# EAGLE design RN52_BO (EAGLE 8.6.0)
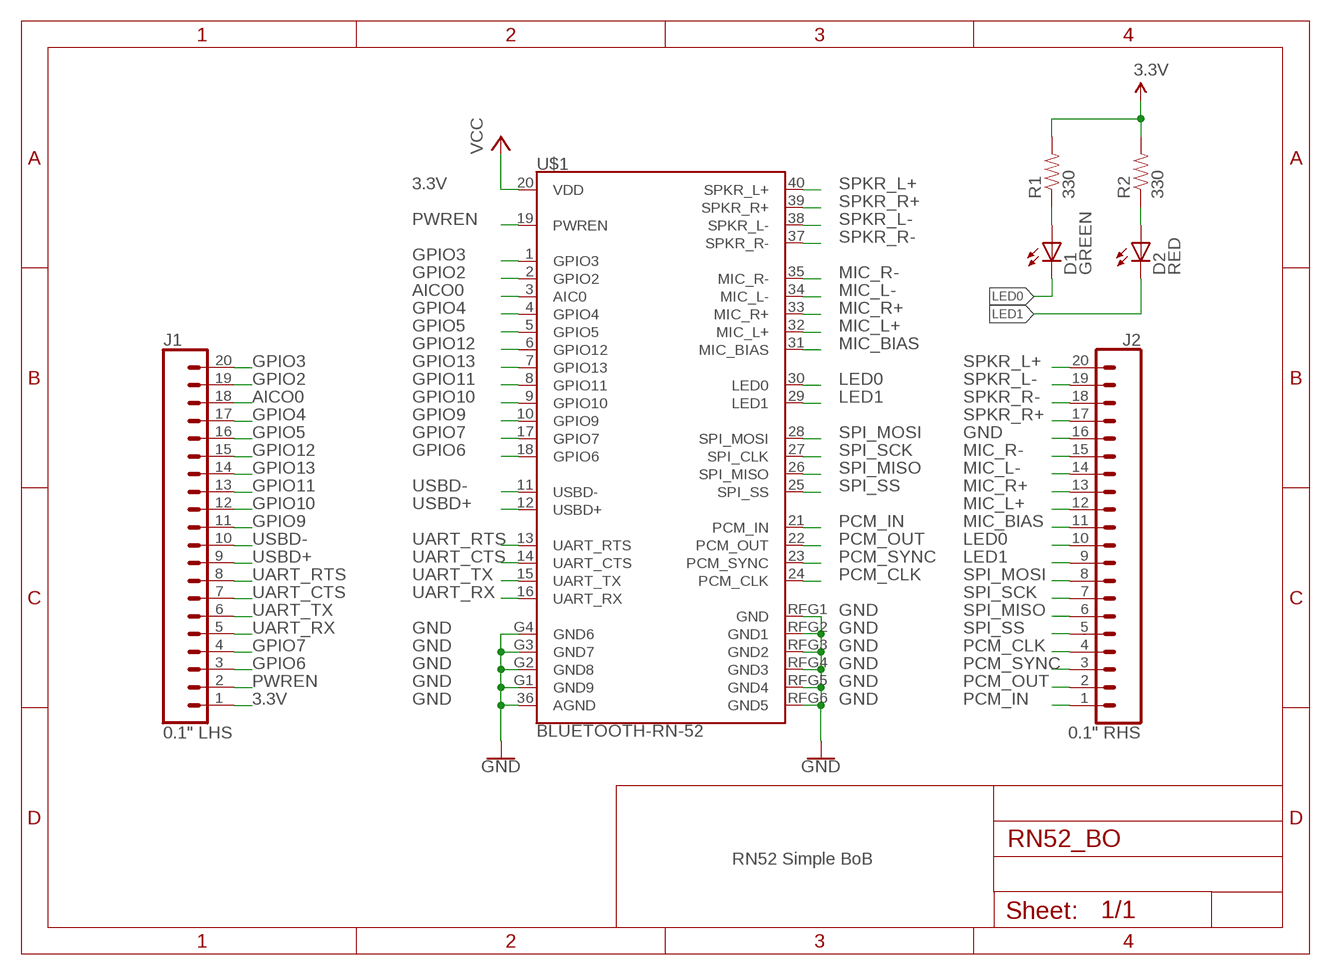
[diagram p0: schematic, sheet 1]
FRAME2 (DINA5_L): RN52BOB: RN52 Simple BoB

## Parts
D1  GREEN  LED-GREEN0603  [LED-0603]
D2  RED  LED-RED0603  [LED-0603]
J1  0.1" LHS  CONN_20  [1X20]
J2  0.1" RHS  CONN_20  [1X20]
R1  330  RESISTOR0603-RES  [0603-RES]
R2  330  RESISTOR0603-RES  [0603-RES]
U$1  BLUETOOTH-RN-52  [RN-52]

## Nets
3.3V: J1.1 R1.2 R2.2 U$1.20(VDD) ; supply symbol labelled VCC
AICO0: J1.18 U$1.3(AIC0)
GND: J2.16 U$1.36(AGND) U$1.G1(GND9) U$1.G2(GND8) U$1.G3(GND7) U$1.G4(GND6) U$1.RFG1(GND) U$1.RFG2(GND1) U$1.RFG3(GND2) U$1.RFG4(GND3) U$1.RFG5(GND4) U$1.RFG6(GND5)
GPIO2: J1.19 U$1.2(GPIO2)
GPIO3: J1.20 U$1.1(GPIO3)
GPIO4: J1.17 U$1.4(GPIO4)
GPIO5: J1.16 U$1.5(GPIO5)
GPIO6: J1.3 U$1.18(GPIO6)
GPIO7: J1.4 U$1.17(GPIO7)
GPIO9: J1.11 U$1.10(GPIO9)
GPIO10: J1.12 U$1.9(GPIO10)
GPIO11: J1.13 U$1.8(GPIO11)
GPIO12: J1.15 U$1.6(GPIO12)
GPIO13: J1.14 U$1.7(GPIO13)
LED0: D1.C J2.10 U$1.30(LED0)
LED1: D2.C J2.9 U$1.29(LED1)
MIC_BIAS: J2.11 U$1.31(MIC_BIAS)
MIC_L+: J2.12 U$1.32(MIC_L+)
MIC_L-: J2.14 U$1.34(MIC_L-)
MIC_R+: J2.13 U$1.33(MIC_R+)
MIC_R-: J2.15 U$1.35(MIC_R-)
N$1: D2.A R2.1
N$2: D1.A R1.1
PCM_CLK: J2.4 U$1.24(PCM_CLK)
PCM_IN: J2.1 U$1.21(PCM_IN)
PCM_OUT: J2.2 U$1.22(PCM_OUT)
PCM_SYNC: J2.3 U$1.23(PCM_SYNC)
PWREN: J1.2 U$1.19(PWREN)
SPI_MISO: J2.6 U$1.26(SPI_MISO)
SPI_MOSI: J2.8 U$1.28(SPI_MOSI)
SPI_SCK: J2.7 U$1.27(SPI_CLK)
SPI_SS: J2.5 U$1.25(SPI_SS)
SPKR_L+: J2.20 U$1.40(SPKR_L+)
SPKR_L-: J2.19 U$1.38(SPKR_L-)
SPKR_R+: J2.17 U$1.39(SPKR_R+)
SPKR_R-: J2.18 U$1.37(SPKR_R-)
UART_CTS: J1.7 U$1.14(UART_CTS)
UART_RTS: J1.8 U$1.13(UART_RTS)
UART_RX: J1.5 U$1.16(UART_RX)
UART_TX: J1.6 U$1.15(UART_TX)
USBD+: J1.9 U$1.12(USBD+)
USBD-: J1.10 U$1.11(USBD-)

## Library data of the parts
D1 = SparkFun-LED:LED-GREEN: Various green LEDs 0603- DIO-00821 LARGE- DIO-00862 LILYPAD- DIO-09910; PROD_ID: DIO-00821
D2 = SparkFun-LED:LED-RED: Assorted Red LEDs LilyPad 1206- DIO-09912 1206- DIO-00809 0603- DIO-00819; PROD_ID: DIO-00819
J1 = SparkFun-Connectors:CONN_20: Multi connection point. Often used as Generic Header-pin footprint for 0.1 inch spaced/style header connections On any of the 0.1 inch spaced packages, you can populate with these: Break Away Headers - Straight <https://www.sparkfun.com/products/116> (PRT-00116) Break Away Male Headers - Right Angle <https://www.sparkfun.com/products/553> (PRT-00553) Female Headers <https://www.sparkfun.com/products/115> (PRT-00115) Break Away Headers - Machine Pin <https://www.sparkfun.com/products/117> (PRT-00117) Break Away Female Headers - Swiss Machine Pin <https://www.sparkfun.com/products/743> (PRT-00743) For SCREWTERMINALS and SPRING TERMINALS visit here: Screw Terimnals on SparkFun.com <https://www.sparkfun.com/search/results?term=Screw+Terminals> (5mm/3.5mm/2.54mm spacing) This device is also useful as a general connection point to wire up your design to another part of your project. Our various solder wires solder well into these plated through hole pads. Hook-Up Wire - Assortment (Stranded, 22 AWG) <https://www.sparkfun.com/products/11375> (PRT-11375) Hook-Up Wire - Assortment (Solid Core, 22 AWG) <https://www.sparkfun.com/products/11367> (PRT-11367) View the entire wire category on our website here <https://www.sparkfun.com/categories/141> Special notes: Molex polarized connector foot print use with SKU : PRT-08231 with associated crimp pins and housings. 1MM SMD Version SKU: PRT-10208 NOTES ON THE VARIANTS LOCK and LOCK_LONGPADS... This footprint was designed to help hold the alignment of a through-hole component (i.e. 6-pin header) while soldering it into place. You may notice that each hole has been shifted either up or down by 0.005 of an inch from it's more standard position (which is a perfectly straight line). This slight alteration caused the pins (the squares in the middle) to touch the edges of the holes. Because they are alternating, it causes a "brace" to hold the component in place. 0.005 has proven to be the perfect amount of "off-center" position when using our standard breakaway headers. Although looks a little odd when you look at the bare footprint, once you have a header in there, the alteration is very hard to notice. Also,if you push a header all the way into place, it is covered up entirely on the bottom side. Note about LOCK SPECIAL package: This is just like the LOCK variant in that the holes are staggared by 5 mil, but except for the last two holes. They are not altered from the "standard" footprint layout. This is used for a special purpose on the layout of our Graphic LCD Backpack. Make sure you want to use this device before selecting it for you project!; TITLE: 0.1" LHS
J2 = SparkFun-Connectors:CONN_20: Multi connection point. Often used as Generic Header-pin footprint for 0.1 inch spaced/style header connections On any of the 0.1 inch spaced packages, you can populate with these: Break Away Headers - Straight <https://www.sparkfun.com/products/116> (PRT-00116) Break Away Male Headers - Right Angle <https://www.sparkfun.com/products/553> (PRT-00553) Female Headers <https://www.sparkfun.com/products/115> (PRT-00115) Break Away Headers - Machine Pin <https://www.sparkfun.com/products/117> (PRT-00117) Break Away Female Headers - Swiss Machine Pin <https://www.sparkfun.com/products/743> (PRT-00743) For SCREWTERMINALS and SPRING TERMINALS visit here: Screw Terimnals on SparkFun.com <https://www.sparkfun.com/search/results?term=Screw+Terminals> (5mm/3.5mm/2.54mm spacing) This device is also useful as a general connection point to wire up your design to another part of your project. Our various solder wires solder well into these plated through hole pads. Hook-Up Wire - Assortment (Stranded, 22 AWG) <https://www.sparkfun.com/products/11375> (PRT-11375) Hook-Up Wire - Assortment (Solid Core, 22 AWG) <https://www.sparkfun.com/products/11367> (PRT-11367) View the entire wire category on our website here <https://www.sparkfun.com/categories/141> Special notes: Molex polarized connector foot print use with SKU : PRT-08231 with associated crimp pins and housings. 1MM SMD Version SKU: PRT-10208 NOTES ON THE VARIANTS LOCK and LOCK_LONGPADS... This footprint was designed to help hold the alignment of a through-hole component (i.e. 6-pin header) while soldering it into place. You may notice that each hole has been shifted either up or down by 0.005 of an inch from it's more standard position (which is a perfectly straight line). This slight alteration caused the pins (the squares in the middle) to touch the edges of the holes. Because they are alternating, it causes a "brace" to hold the component in place. 0.005 has proven to be the perfect amount of "off-center" position when using our standard breakaway headers. Although looks a little odd when you look at the bare footprint, once you have a header in there, the alteration is very hard to notice. Also,if you push a header all the way into place, it is covered up entirely on the bottom side. Note about LOCK SPECIAL package: This is just like the LOCK variant in that the holes are staggared by 5 mil, but except for the last two holes. They are not altered from the "standard" footprint layout. This is used for a special purpose on the layout of our Graphic LCD Backpack. Make sure you want to use this device before selecting it for you project!; TITLE: 0.1" RHS
R1 R2 = SparkFun-Resistors:RESISTOR: Resistor Basic schematic elements and footprints for 0603, 1206, and PTH resistors.
U$1 = SparkFun-RF:BLUETOOTH-RN-52: Roving Networks RN-52 Bluetooth Audio Module The RN-52 is an audio module that provides a highly integrated solution for delivering high quality stereo audio in a small form factor with little difficulty. This module is perfect for a project involving hands free audio for your car, remote controlling your media center, or streaming 2-channel audio. SparkFun Products: RN-52 - Bluetooth Audio Module <https://www.sparkfun.com/products/11678> (WRL-11678) Audio Bluetooth Breakout - RN-52 <https://www.sparkfun.com/products/12849> (WRL-12849); PROD_ID: IC-11569; SF_ID: WRL-11678

## Board
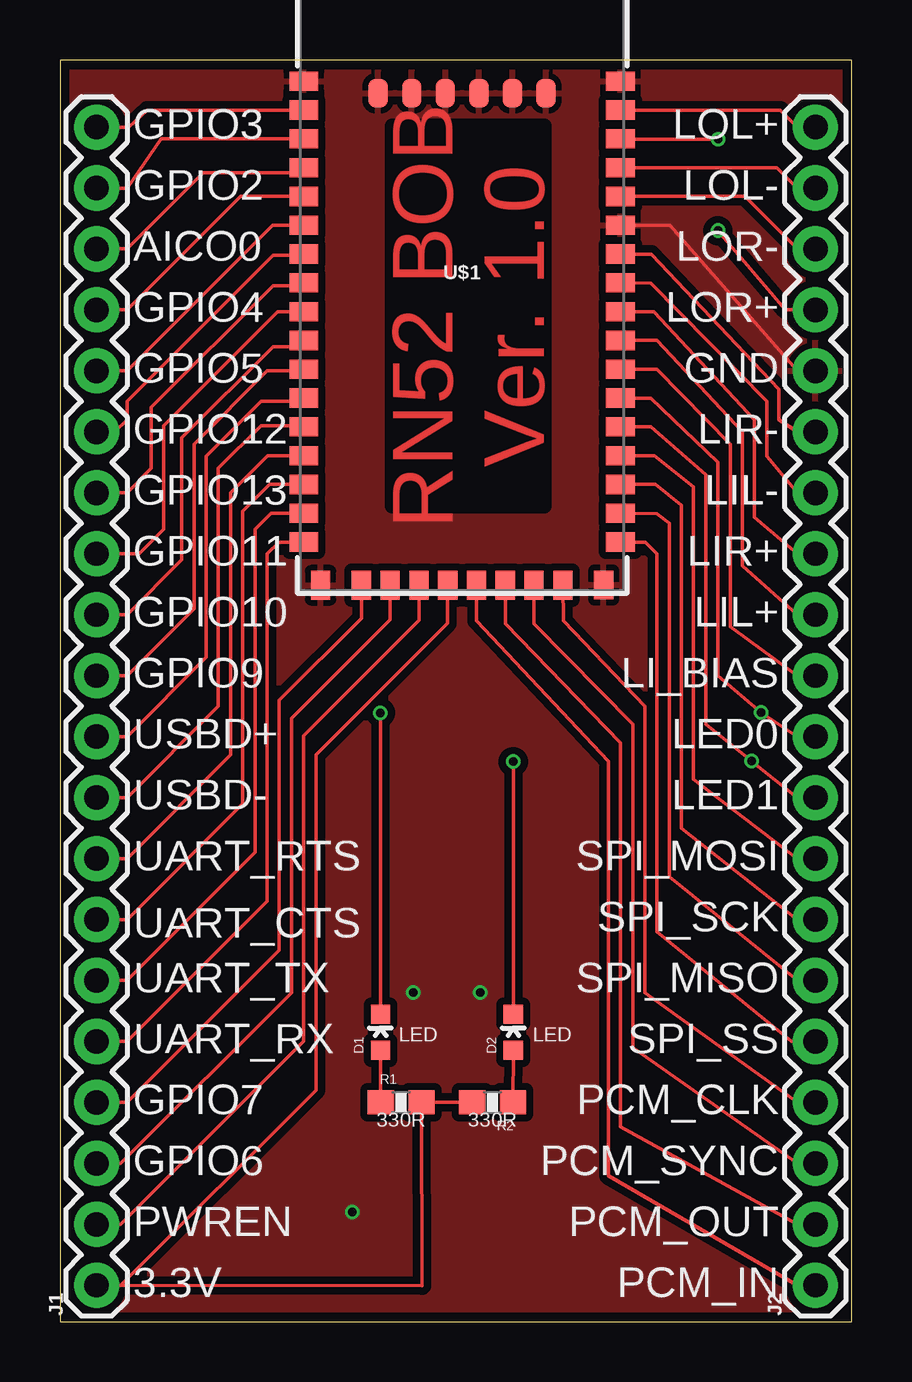
[diagram p1: board, top side]
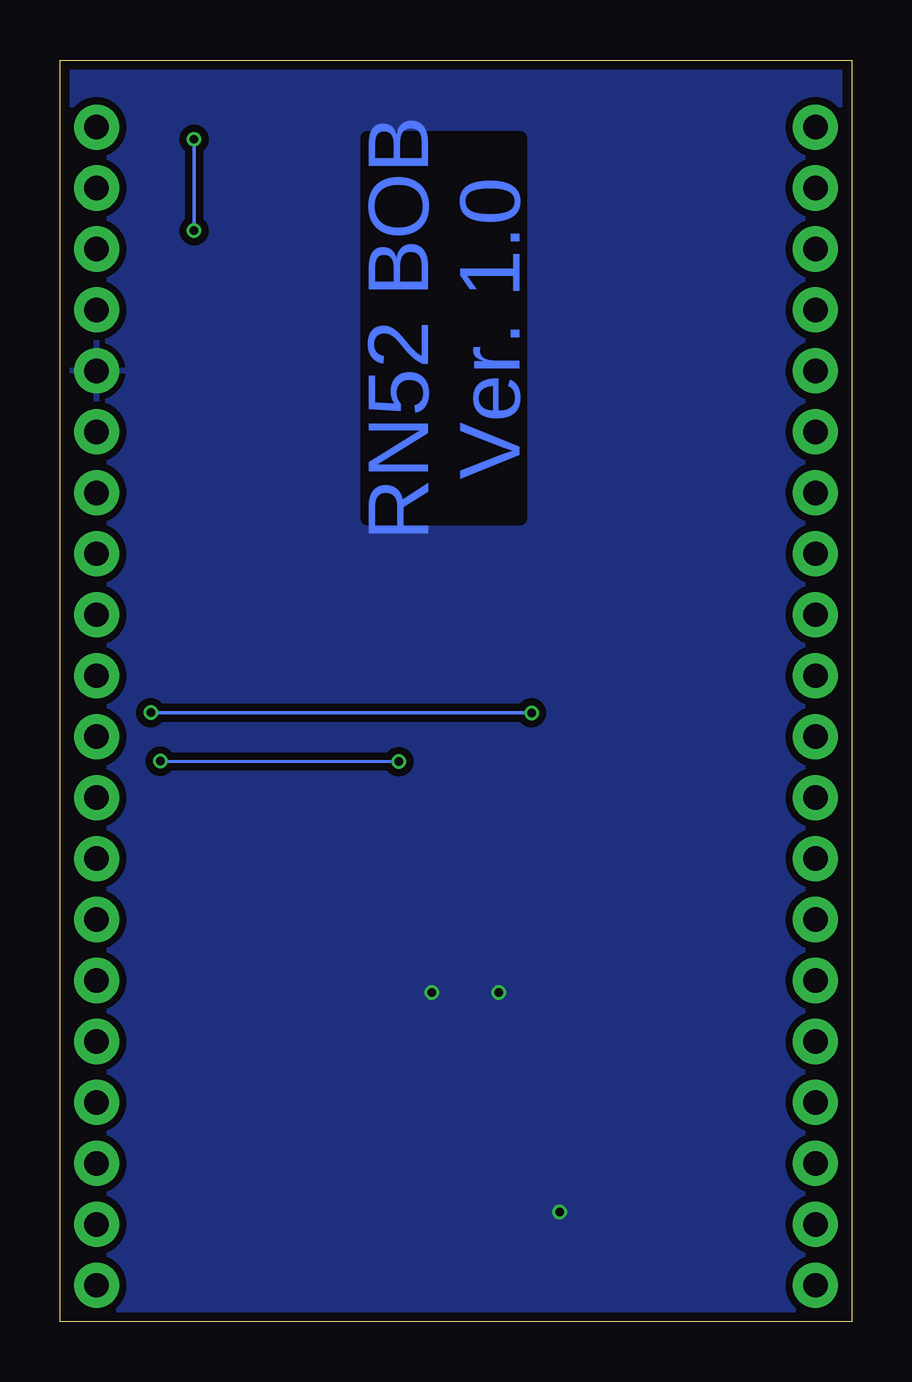
[diagram p2: board, bottom side, seen from below]

Size 33.02 x 52.58 mm. Coordinates in mm from the lower left corner, seen from the top.
Outline: 0,0 33.02,0 33.02,52.58 0,52.58 0,0
Copper layers (1*16): Top 0.035559375mm / dielectric 1.6mm / Bottom 0.035559375mm
Design rules "oshpark-2layer": minimum track width 6mil, minimum drill 10mil, track to track 6mil, track to pad 6mil, pad to pad 6mil, via to via 6mil, smd to smd 6mil, copper to edge 15mil, drill to drill 6mil, minimum pad ring 5mil, minimum via ring 5mil, stop-mask expansion 2.5mil, vias tented up to drill 0mil, thermal gap 10mil

### Footprints (pad centres in the part's own frame; a part is rotated, then mirrored left to right if it is on the bottom)
LED-0603 = smd 0.8 x 0.8: A 0,-0.75; C 0,0.75
1X20 = drill 1.016 pad 1.88: 1 0,0; 2 2.54,0; 3 5.08,0; 4 7.62,0; 5 10.16,0; 6 12.7,0; 7 15.24,0; 8 17.78,0; 9 20.32,0; 10 22.86,0; 11 25.4,0; 12 27.94,0; 13 30.48,0; 14 33.02,0; 15 35.56,0; 16 38.1,0; 17 40.64,0; 18 43.18,0; 19 45.72,0; 20 48.26,0
0603-RES = smd 1.1 x 1: 1 -0.85,0; 2 0.85,0
RN-52 = smd 1.2 x 0.8: 1 -6.6,8.33; 2 -6.6,7.13; 3 -6.6,5.93; 4 -6.6,4.73; 5 -6.6,3.53; 6 -6.6,2.33; 7 -6.6,1.13; 8 -6.6,-0.07; 9 -6.6,-1.27; 10 -6.6,-2.47; 11 -6.6,-3.67; 12 -6.6,-4.87; 13 -6.6,-6.07; 14 -6.6,-7.27; 15 -6.6,-8.47; 16 -6.6,-9.67; 25 6.6,-9.67; 26 6.6,-8.47; 27 6.6,-7.27; 28 6.6,-6.07; 29 6.6,-4.87; 30 6.6,-3.67; 31 6.6,-2.47; 32 6.6,-1.27; 33 6.6,-0.07; 34 6.6,1.13; 35 6.6,2.33; 36 6.6,3.53; 37 6.6,4.73; 38 6.6,5.93; 39 6.6,7.13; 40 6.6,8.33; G1 -6.6,9.53; G4 6.6,9.53 | smd 0.8 x 1.2: 17 -4.2,-11.47; 18 -3,-11.47; 19 -1.8,-11.47; 20 -0.6,-11.47; 21 0.6,-11.47; 22 1.8,-11.47; 23 3,-11.47; 24 4.2,-11.47; G2 -5.9,-11.47; G3 5.9,-11.46; RFG1 -3.5,9.03; RFG2 -2.1,9.03; RFG3 -0.7,9.03; RFG4 0.7,9.03; RFG5 2.1,9.03; RFG6 3.5,9.03

### Placement (x,y rotation side)
D1  13.36,12.06 0 top
D2  18.9,12.06 0 top
J1  1.52,1.52 90 top
J2  31.5,1.52 90 top
R1  14.22,9.14 0 top
R2  18.03,9.14 180 top
U$1  16.76,42.16 0 top

### Tracks (layer width: path | path; a pad name or v marks a point on that pad's centre or on a via)
3.3V
  Top 0.152: R2.2 R1.2 15.09,1.5 2.54,1.52 | U$1.20 16.16,29.12 10.67,23.62 10.67,9.65 2.54,1.52 | 2.54,1.52 J1.1
AICO0
  Top 0.152: J1.18 2.79,44.7 5.97,47.88 9.95,47.88 U$1.3
GND  (via drill 0.35)
  Top 0.152: J2.16 30.73,39.62 25.43,45.7 24.66,45.7 U$1.36
  other vias: 12.19,4.57 14.73,13.72 17.53,13.72
  pour Top (isolate 0.305): 0,52.58 33.02,52.58 33.02,0 0,0
  pour Bottom (isolate 0.305): 0,52.58 33.02,52.58 33.02,0 0,0
GPIO2
  Top 0.152: J1.19 2.79,47.24 4.21,49.29 U$1.2
GPIO3
  Top 0.152: J1.20 2.87,49.78 3.63,50.49 U$1.1
GPIO4
  Top 0.152: J1.17 2.79,42.16 7.52,46.89 U$1.4
GPIO5
  Top 0.152: J1.16 2.79,39.62 8.86,45.69 U$1.5
GPIO6
  Top 0.152: U$1.18 13.76,29.26 9.65,25.15 9.65,13.72 2.54,6.6 J1.3
GPIO7
  Top 0.152: U$1.17 12.56,29.33 9.14,25.91 9.14,15.49 2.79,9.14 J1.4
GPIO9
  Top 0.152: J1.11 2.79,26.92 5.59,29.72 5.59,36.58 8.64,39.62 10.09,39.62 U$1.10
GPIO10
  Top 0.152: J1.12 2.79,29.46 5.08,31.75 5.08,36.83 8.89,40.64 9.91,40.64 U$1.9
GPIO11
  Top 0.152: U$1.8 9.07,42.09 4.32,37.34 4.32,33.02 3.3,32 J1.13
GPIO12
  Top 0.152: U$1.6 10.12,44.45 8.89,44.45 2.79,38.35 2.79,37.59 2.29,37.08 J1.15
GPIO13
  Top 0.152: J1.14 2.79,34.54 3.81,35.56 3.81,38.1 8.89,43.18 10.05,43.18 U$1.7
LED0  (via drill 0.35)
  Top 0.152: J2.10 30.73,24.38 v29.23,25.39 27.43,26.92 27.43,35.81 24.64,38.48 U$1.30 | v13.36,25.38 D1.C
  Bottom 0.152: v29.23,25.39 v13.36,25.38
LED1  (via drill 0.35)
  Top 0.152: J2.9 30.73,21.84 28.91,23.31 v28.84,23.36 26.92,24.89 26.92,35.31 24.64,37.29 U$1.29 | D2.C v18.9,23.34
  Bottom 0.152: v28.84,23.36 v18.9,23.34
MIC_BIAS
  Top 0.152: J2.11 30.73,26.92 27.94,28.96 27.94,36.58 24.89,39.7 U$1.31
MIC_L+
  Top 0.152: J2.12 30.73,29.46 28.45,31.5 28.45,37.08 24.89,40.89 U$1.32
MIC_L-
  Top 0.152: J2.14 30.73,34.54 29.46,36.07 29.46,38.35 24.64,43.28 U$1.34
MIC_R+
  Top 0.152: J2.13 30.73,32 28.96,33.53 28.96,37.59 24.77,42.09 U$1.33
MIC_R-
  Top 0.152: J2.15 30.73,37.08 29.97,37.59 29.97,38.86 24.66,44.48 U$1.35
N$1
  Top 0.152: D2.A R2.1
N$2
  Top 0.152: D1.A R1.1
PCM_CLK
  Top 0.152: J2.4 30.73,9.14 24.38,13.72 24.38,25.65 20.98,29.21 U$1.24
PCM_IN
  Top 0.152: U$1.21 17.36,29.21 22.86,23.37 22.86,6.1 30.73,1.52 J2.1
PCM_OUT
  Top 0.152: J2.2 30.73,4.06 23.37,8.13 23.37,24.13 18.57,29.08 U$1.22
PCM_SYNC
  Top 0.152: J2.3 30.73,6.6 23.88,11.43 23.88,24.89 19.76,29.08 U$1.23
PWREN
  Top 0.152: U$1.19 14.96,29.23 10.16,24.43 10.16,11.68 2.54,4.06 J1.2
SPI_MISO
  Top 0.152: J2.6 30.73,14.22 25.4,18.54 25.4,33.27 24.89,33.68 | U$1.26 24.89,33.68 | 24.89,33.68
SPI_MOSI
  Top 0.152: J2.8 30.73,19.3 26.42,22.61 26.42,34.8 24.79,36.09 U$1.28
SPI_SCK
  Top 0.152: J2.7 30.73,16.76 25.91,20.57 25.91,34.04 24.82,34.9 24.64,34.9 U$1.27
SPI_SS
  Top 0.152: U$1.25 24.41,32.49 24.89,32 24.89,16.26 30.48,11.68 J2.5
SPKR_L+
  Top 0.152: J2.20 30.73,49.78 30.02,50.49 U$1.40
SPKR_L-
  Top 0.152: J2.19 30.73,47.24 29.88,48.09 U$1.38
SPKR_R+  (via drill 0.35)
  Top 0.152: J2.17 30.25,42.16 v27.43,45.47 | U$1.39 23.38,49.28 v27.43,49.28
  Bottom 0.152: v27.43,45.47 v27.43,49.28
SPKR_R-
  Top 0.152: J2.18 30.73,44.7 28.54,46.89 U$1.37
UART_CTS
  Top 0.152: J1.7 2.79,16.76 7.62,21.59 7.62,33.78 8.73,34.89 U$1.14
UART_RTS
  Top 0.152: J1.8 2.79,19.3 7.11,23.62 7.11,34.54 8.66,36.09 U$1.13
UART_RX
  Top 0.152: U$1.16 9.13,32.49 8.64,32 8.64,17.53 2.79,11.68 J1.5
UART_TX
  Top 0.152: J1.6 2.79,14.22 8.13,19.56 8.13,33.02 8.8,33.69 U$1.15
USBD+
  Top 0.152: J1.9 2.79,21.84 6.6,25.65 6.6,35.56 8.38,37.34 10.12,37.34 U$1.12
USBD-
  Top 0.152: J1.10 2.79,24.38 6.1,27.69 6.1,36.07 8.38,38.35 10.02,38.35 U$1.11

### Text on the board
Top: RN52 BOB / Ver. 1.0
Bottom: RN52 BOB / Ver. 1.0
tPlace: GPIO3 | LOL+ | GPIO2 | LOL- | AICO0 | LOR- | GPIO4 | LOR+ | GPIO5 | GND | GPIO12 | LIR- | GPIO13 | LIL- | GPIO11 | LIR+ | GPIO10 | LIL+ | GPIO9 | LI_BIAS | USBD+ | LED0 | USBD- | LED1 | UART_RTS | SPI_MOSI | UART_CTS | SPI_SCK | UART_TX | SPI_MISO | LED | LED | UART_RX | SPI_SS | GPIO7 | PCM_CLK | 330R | 330R | GPIO6 | PCM_SYNC | PWREN | PCM_OUT | 3.3V | PCM_IN